# Altium schematic sheet Remote_Control_Top.SchDoc
size Letter
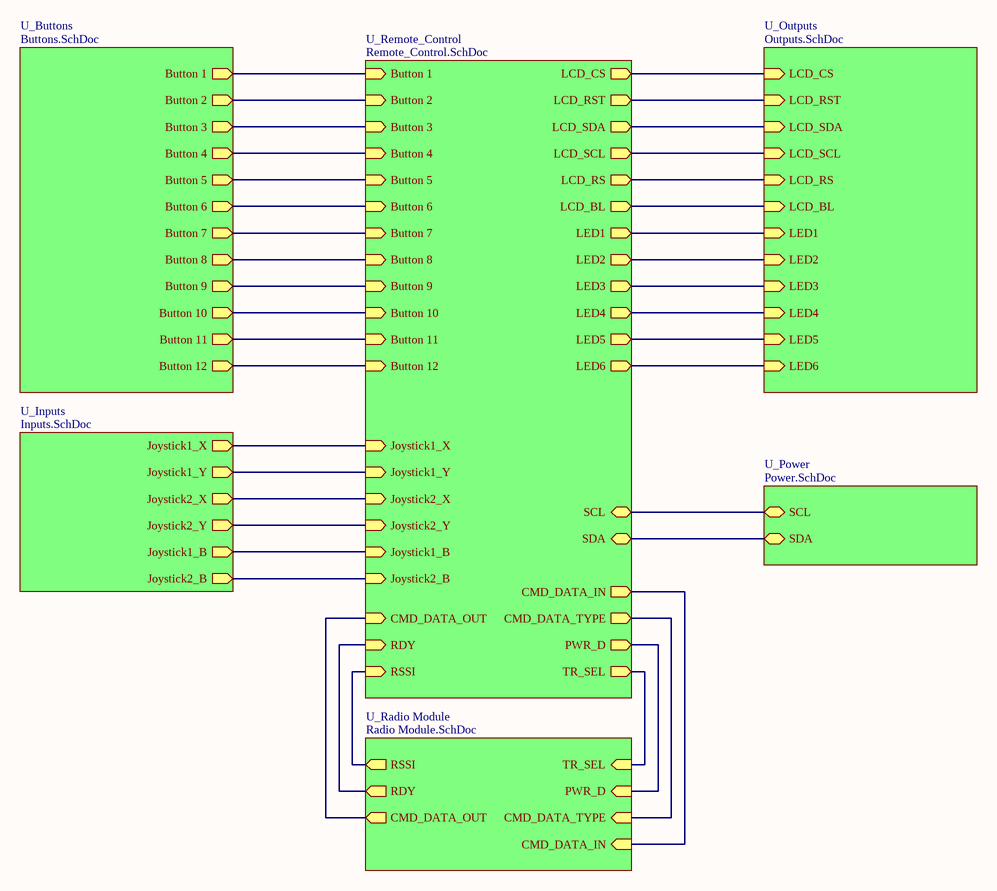
[diagram p0: Remote_Control_Top.SchDoc]

## Sub-sheets
U_Buttons = Buttons.SchDoc: Button 1 (out), Button 3 (out), Button 5 (out), Button 2 (out), Button 4 (out), Button 6 (out), Button 7 (out), Button 8 (out), Button 9 (out), Button 10 (out), Button 11 (out), Button 12 (out)
U_Inputs = Inputs.SchDoc: Joystick1_X (out), Joystick1_Y (out), Joystick2_X (out), Joystick2_Y (out), Joystick2_B (out), Joystick1_B (out)
U_Outputs = Outputs.SchDoc: LCD_RS (in), LCD_SCL (in), LCD_SDA (in), LCD_RST (in), LCD_CS (in), LCD_BL (in), LED1 (in), LED2 (in), LED3 (in), LED4 (in), LED5 (in), LED6 (in)
U_Power = Power.SchDoc: SCL (bidir), SDA (bidir)
U_Radio Module = Radio Module.SchDoc: RSSI (out), RDY (out), TR_SEL (in), PWR_D (in), CMD_DATA_TYPE (in), CMD_DATA_OUT (out), CMD_DATA_IN (in)
U_Remote_Control = Remote_Control.SchDoc: Button 1 (in), Button 2 (in), Button 3 (in), Button 4 (in), Button 5 (in), Joystick1_X (in), Joystick1_Y (in), Joystick2_X (in), Joystick2_Y (in), Button 6 (in), LCD_CS (out), LCD_RST (out), LCD_SDA (out), LCD_SCL (out), LCD_RS (out), LCD_BL (out), LED1 (out), LED2 (out), LED3 (out), LED4 (out), LED5 (out), LED6 (out), Button 7 (in), Button 8 (in), Button 9 (in), Button 10 (in), Button 11 (in), Button 12 (in), RSSI (in), CMD_DATA_IN (out), CMD_DATA_OUT (in), CMD_DATA_TYPE (out), PWR_D (out), TR_SEL (out), RDY (in), SDA (bidir), SCL (bidir), Joystick1_B (in), Joystick2_B (in)

## Nets
(unnamed): sheet U_Buttons/Button 1, sheet U_Remote_Control/Button 1
(unnamed): sheet U_Buttons/Button 3, sheet U_Remote_Control/Button 3
(unnamed): sheet U_Buttons/Button 5, sheet U_Remote_Control/Button 5
(unnamed): sheet U_Buttons/Button 2, sheet U_Remote_Control/Button 2
(unnamed): sheet U_Buttons/Button 4, sheet U_Remote_Control/Button 4
(unnamed): sheet U_Buttons/Button 6, sheet U_Remote_Control/Button 6
(unnamed): sheet U_Buttons/Button 7, sheet U_Remote_Control/Button 7
(unnamed): sheet U_Buttons/Button 8, sheet U_Remote_Control/Button 8
(unnamed): sheet U_Buttons/Button 9, sheet U_Remote_Control/Button 9
(unnamed): sheet U_Buttons/Button 10, sheet U_Remote_Control/Button 10
(unnamed): sheet U_Buttons/Button 11, sheet U_Remote_Control/Button 11
(unnamed): sheet U_Buttons/Button 12, sheet U_Remote_Control/Button 12
(unnamed): sheet U_Outputs/LCD_RS, sheet U_Remote_Control/LCD_RS
(unnamed): sheet U_Outputs/LCD_SCL, sheet U_Remote_Control/LCD_SCL
(unnamed): sheet U_Outputs/LCD_SDA, sheet U_Remote_Control/LCD_SDA
(unnamed): sheet U_Outputs/LCD_RST, sheet U_Remote_Control/LCD_RST
(unnamed): sheet U_Outputs/LCD_CS, sheet U_Remote_Control/LCD_CS
(unnamed): sheet U_Outputs/LCD_BL, sheet U_Remote_Control/LCD_BL
(unnamed): sheet U_Outputs/LED1, sheet U_Remote_Control/LED1
(unnamed): sheet U_Outputs/LED2, sheet U_Remote_Control/LED2
(unnamed): sheet U_Outputs/LED3, sheet U_Remote_Control/LED3
(unnamed): sheet U_Outputs/LED4, sheet U_Remote_Control/LED4
(unnamed): sheet U_Outputs/LED5, sheet U_Remote_Control/LED5
(unnamed): sheet U_Outputs/LED6, sheet U_Remote_Control/LED6
(unnamed): sheet U_Radio Module/RSSI, sheet U_Remote_Control/RSSI
(unnamed): sheet U_Radio Module/RDY, sheet U_Remote_Control/RDY
(unnamed): sheet U_Radio Module/TR_SEL, sheet U_Remote_Control/TR_SEL
(unnamed): sheet U_Radio Module/PWR_D, sheet U_Remote_Control/PWR_D
(unnamed): sheet U_Radio Module/CMD_DATA_TYPE, sheet U_Remote_Control/CMD_DATA_TYPE
(unnamed): sheet U_Radio Module/CMD_DATA_OUT, sheet U_Remote_Control/CMD_DATA_OUT
(unnamed): sheet U_Radio Module/CMD_DATA_IN, sheet U_Remote_Control/CMD_DATA_IN
(unnamed): sheet U_Remote_Control/Joystick1_X, sheet U_Inputs/Joystick1_X
(unnamed): sheet U_Remote_Control/Joystick1_Y, sheet U_Inputs/Joystick1_Y
(unnamed): sheet U_Remote_Control/Joystick2_X, sheet U_Inputs/Joystick2_X
(unnamed): sheet U_Remote_Control/Joystick2_Y, sheet U_Inputs/Joystick2_Y
(unnamed): sheet U_Remote_Control/SDA, sheet U_Power/SDA
(unnamed): sheet U_Remote_Control/SCL, sheet U_Power/SCL
(unnamed): sheet U_Remote_Control/Joystick1_B, sheet U_Inputs/Joystick1_B
(unnamed): sheet U_Remote_Control/Joystick2_B, sheet U_Inputs/Joystick2_B